# Altium schematic sheet 11_Power.SchDoc: Power (part 1 of 3)
size A3; Organization: Lime Microsystems; Address1: Surrey Tech Centre; Address2: Guildford GU2 7YG; Address3: Surrey; Address4: United Kingdom; SheetNumber: 11
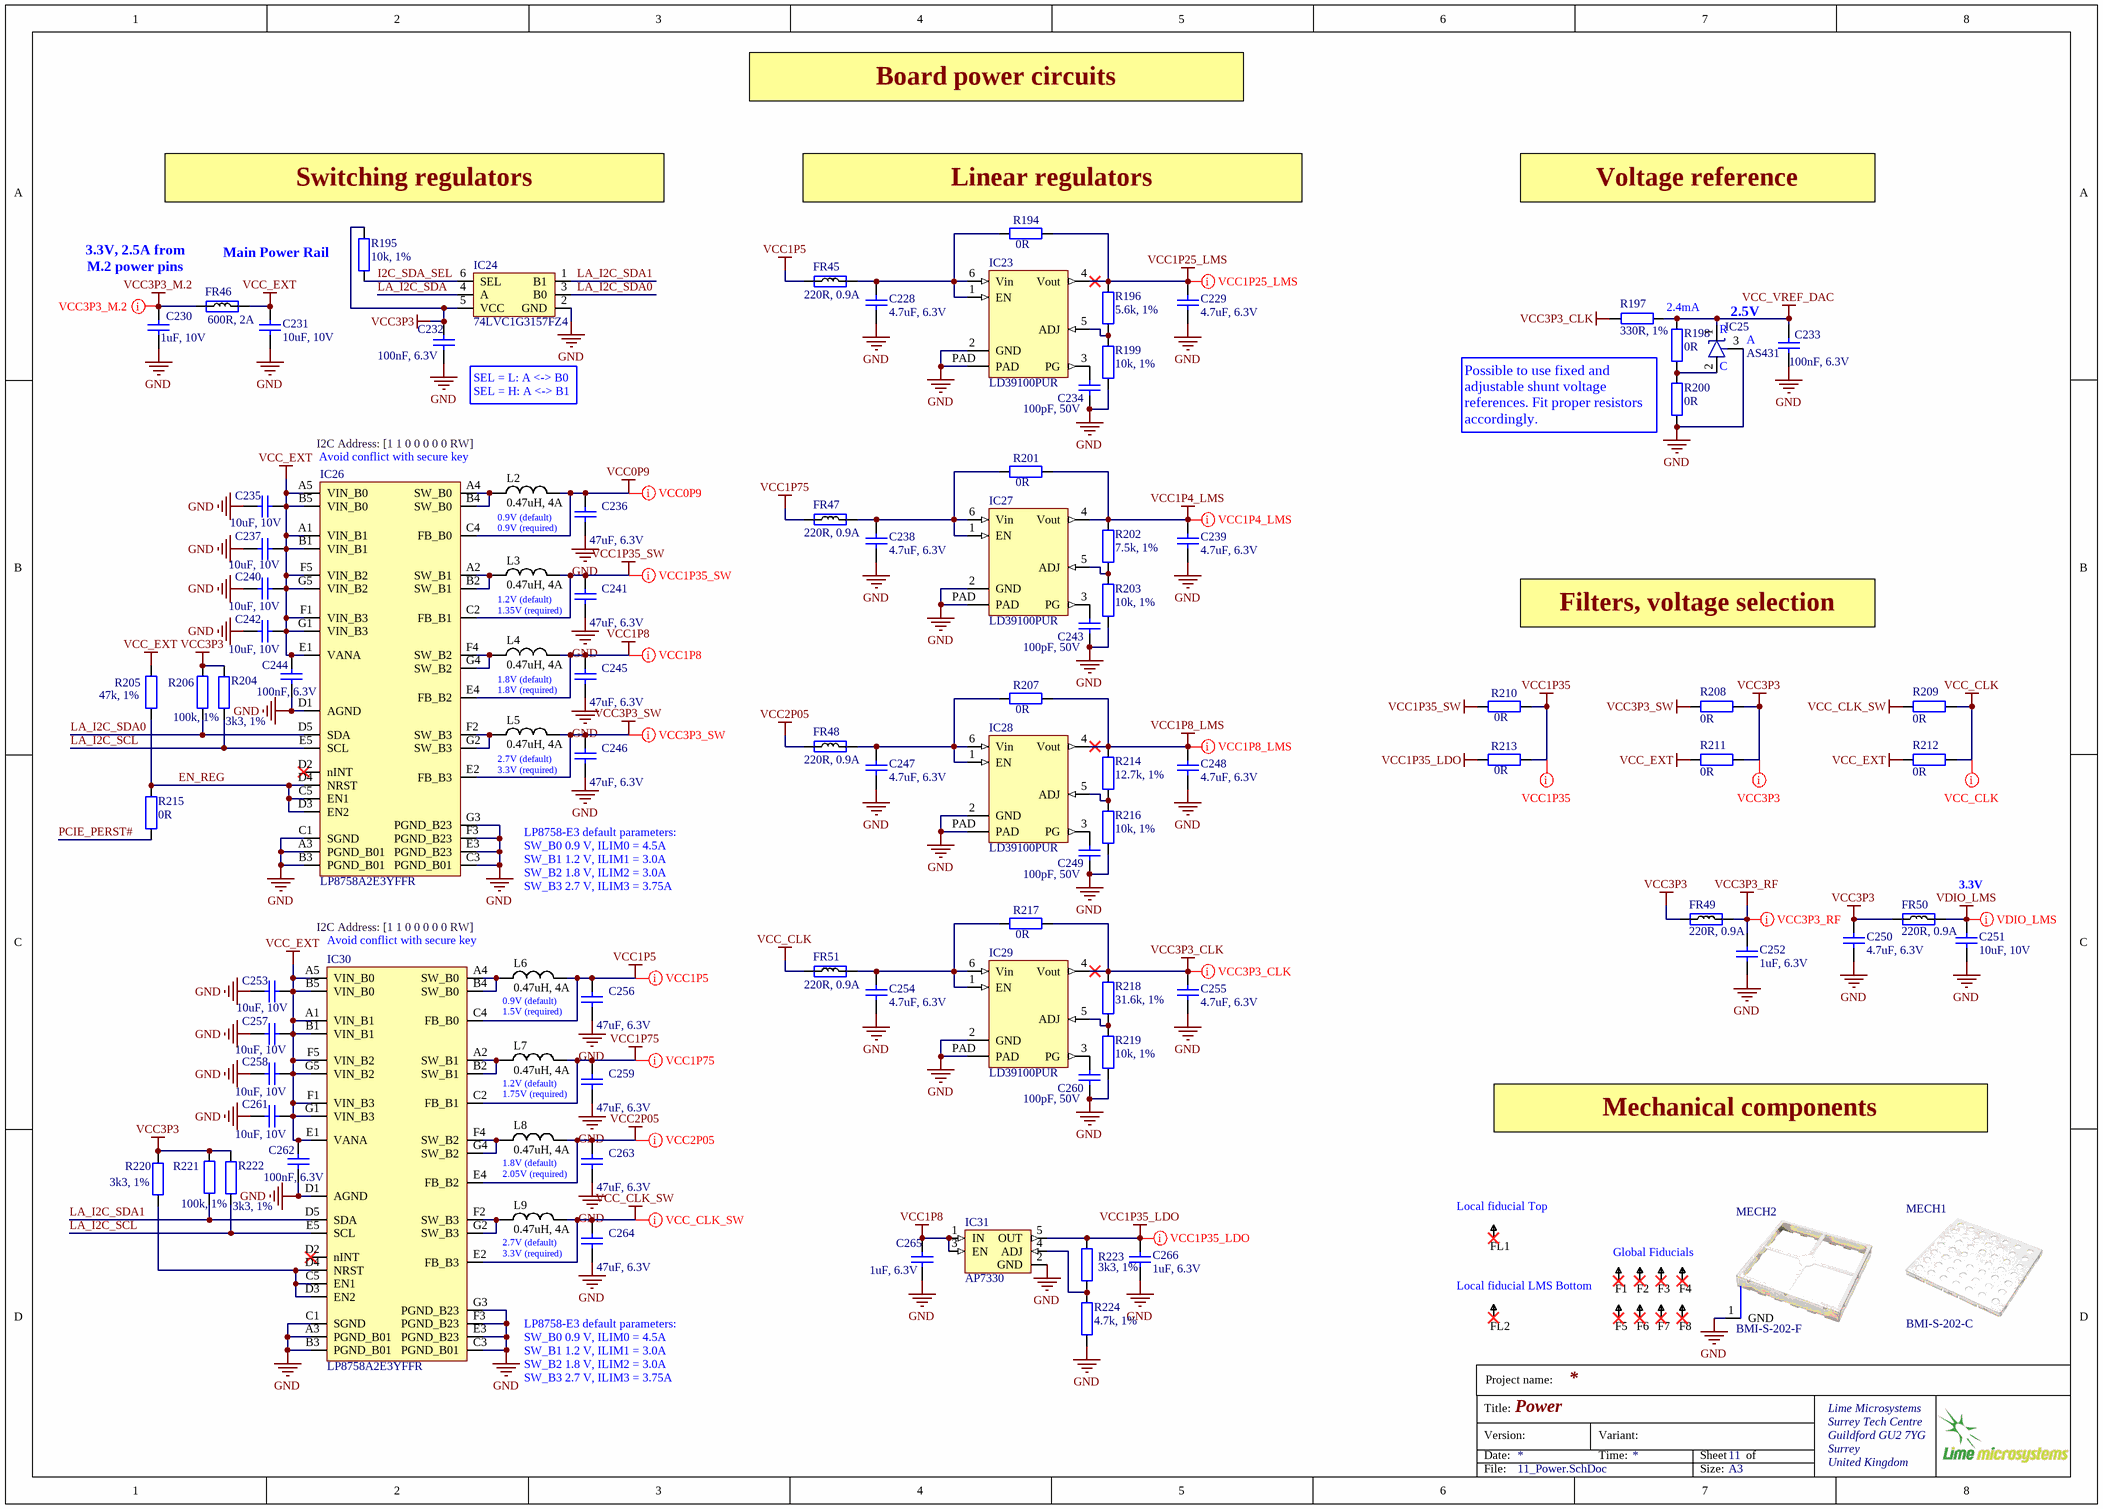
[diagram p0: 11_Power.SchDoc]

## Parts
C228  4.7uF, 6.3V  [CAP0402]
C229  4.7uF, 6.3V  [CAP0402]
C230  1uF, 10V  [CAP0402]
C231  10uF, 10V  [CAP0603]
C232  100nF, 6.3V  [CAP0201]
C233  100nF, 6.3V  [CAP0201]
C234  100pF, 50V  [CAP0201]
C235  10uF, 10V  [CAP0603]
C236  47uF, 6.3V  [CAP0603]
C237  10uF, 10V  [CAP0603]
C238  4.7uF, 6.3V  [CAP0402]
C239  4.7uF, 6.3V  [CAP0402]
C240  10uF, 10V  [CAP0603]
C241  47uF, 6.3V  [CAP0603]
C242  10uF, 10V  [CAP0603]
C243  100pF, 50V  [CAP0201]
C244  100nF, 6.3V  [CAP0201]
C245  47uF, 6.3V  [CAP0603]
C246  47uF, 6.3V  [CAP0603]
C247  4.7uF, 6.3V  [CAP0402]
C248  4.7uF, 6.3V  [CAP0402]
C249  100pF, 50V  [CAP0201]
C250  4.7uF, 6.3V  [CAP0402]
C251  10uF, 10V  [CAP0603]
C252  1uF, 6.3V  [CAP0201]
C253  10uF, 10V  [CAP0603]
C254  4.7uF, 6.3V  [CAP0402]
C255  4.7uF, 6.3V  [CAP0402]
C256  47uF, 6.3V  [CAP0603]
C257  10uF, 10V  [CAP0603]
C258  10uF, 10V  [CAP0603]
C259  47uF, 6.3V  [CAP0603]
C260  100pF, 50V  [CAP0201]
C261  10uF, 10V  [CAP0603]
C262  100nF, 6.3V  [CAP0201]
C263  47uF, 6.3V  [CAP0603]
C264  47uF, 6.3V  [CAP0603]
C265  1uF, 6.3V  [CAP0201]
C266  1uF, 6.3V  [CAP0201]
F1  Fiducial  [Fiducial]  (value not drawn)
F2  Fiducial  [Fiducial]  (value not drawn)
F3  Fiducial  [Fiducial]  (value not drawn)
F4  Fiducial  [Fiducial]  (value not drawn)
F5  Fiducial  [Fiducial]  (value not drawn)
F6  Fiducial  [Fiducial]  (value not drawn)
F7  Fiducial  [Fiducial]  (value not drawn)
F8  Fiducial  [Fiducial]  (value not drawn)
FL1  Fiducial  [Fiducial_local]  (value not drawn)
FL2  Fiducial  [Fiducial_local]  (value not drawn)
FR45  220R, 0.9A  [RES0402]
FR46  600R, 2A  [RES0805]
FR47  220R, 0.9A  [RES0402]
FR48  220R, 0.9A  [RES0402]
FR49  220R, 0.9A  [RES0402]
FR50  220R, 0.9A  [RES0402]
FR51  220R, 0.9A  [RES0402]
IC23  LD39100PUR  [LD39100PUR]
IC24  74LVC1G3157FZ4  [74LVC1G3157FZ4_SPDT_SW_DFN1410-6]
IC25  AS431  [SOT23-3_v3]
IC26  LP8758A2E3YFFR  [LP8758A1E0YFFR_QUAD_DC-DC_35DSBGA]
IC27  LD39100PUR  [LD39100PUR]
IC28  LD39100PUR  [LD39100PUR]
IC29  LD39100PUR  [LD39100PUR]
IC30  LP8758A2E3YFFR  [LP8758A1E0YFFR_QUAD_DC-DC_35DSBGA]
IC31  AP7330  [AP7330-W5-7_SOT25]
L2  0.47uH, 4A  [IND0806]
L3  0.47uH, 4A  [IND0806]
L4  0.47uH, 4A  [IND0806]
L5  0.47uH, 4A  [IND0806]
L6  0.47uH, 4A  [IND0806]
L7  0.47uH, 4A  [IND0806]
L8  0.47uH, 4A  [IND0806]
L9  0.47uH, 4A  [IND0806]
MECH1  BMI-S-202-C  [BMI-S-202-C_RF_SHIELD_COVER]
MECH2  BMI-S-202-F  [BMI-S-202-F_RF_SHIELD_FRAME_v3]
R194  0R  [RES0201]
R195  10k, 1%  [RES0201]
R196  5.6k, 1%  [RES0201]
R197  330R, 1%  [RES0201]
R198  0R  [RES0201]
R199  10k, 1%  [RES0201]
R200  0R  [RES0201]
R201  0R  [RES0201]
R202  7.5k, 1%  [RES0201]
R203  10k, 1%  [RES0201]
R204  3k3, 1%  [RES0201]
R205  47k, 1%  [RES0201]
R206  100k, 1%  [RES0201]
R207  0R  [RES0201]
R208  0R  [RES0402]
R209  0R  [RES0402]
R210  0R  [RES0201]
R211  0R  [RES0402]
R212  0R  [RES0402]
R213  0R  [RES0201]
R214  12.7k, 1%  [RES0201]
R215  0R  [RES0201]
R216  10k, 1%  [RES0201]
R217  0R  [RES0201]
R218  31.6k, 1%  [RES0201]
R219  10k, 1%  [RES0201]
R220  3k3, 1%  [RES0201]
R221  100k, 1%  [RES0201]
R222  3k3, 1%  [RES0201]
R223  3k3, 1%  [RES0201]
R224  4.7k, 1%  [RES0201]

## Nets
GND: C228.1 C229.1 C230.1 C231.1 C232.2 C233.2 C234.1 C235.1 C236.1 C237.1 C238.1 C239.1 C240.1 C241.1 C242.1 C243.1 C244.2 C245.1 C246.1 C247.1 C248.1 C249.1 C250.1 C251.1 C252.2 C253.1 C254.1 C255.1 C256.1 C257.1 C258.1 C259.1 C260.1 C261.1 C262.2 C263.1 C264.1 C265.2 C266.2 IC23.2(GND) IC23.PAD IC24.2(GND) IC25.3(NC/A) IC26.A3(PGND_B01) IC26.B3(PGND_B01) IC26.C1(SGND) IC26.C3(PGND_B01) IC26.D1(AGND) IC26.E3(PGND_B23) IC26.F3(PGND_B23) IC26.G3(PGND_B23) IC27.2(GND) IC27.PAD IC28.2(GND) IC28.PAD IC29.2(GND) IC29.PAD IC30.A3(PGND_B01) IC30.B3(PGND_B01) IC30.C1(SGND) IC30.C3(PGND_B01) IC30.D1(AGND) IC30.E3(PGND_B23) IC30.F3(PGND_B23) IC30.G3(PGND_B23) IC31.2(GND) MECH2.1(GND) R199.2 R200.2 R203.2 R216.2 R219.2 R224.2
VCC0P9: C236.2 IC26.C4(FB_B0) L2.2
VCC1P4_LMS: C239.2 IC27.4(Vout) R201.2 R202.1
VCC1P5: C256.2 FR45.1 IC30.C4(FB_B0) L6.2
VCC1P8: C245.2 C265.1 IC26.E4(FB_B2) IC31.1(IN) IC31.3(EN) L4.2
VCC1P8_LMS: C248.2 IC28.4(Vout) R207.2 R214.1
VCC1P25_LMS: C229.2 IC23.4(Vout) R194.2 R196.1
VCC1P35: R210.2 R213.2
VCC1P35_LDO: C266.1 IC31.5(OUT) R213.1 R223.1
VCC1P35_SW: C241.2 IC26.C2(FB_B1) L3.2 R210.1
VCC1P75: C259.2 FR47.1 IC30.C2(FB_B1) L7.2
VCC2P05: C263.2 FR48.1 IC30.E4(FB_B2) L8.2
VCC3P3: C232.1 C250.2 FR49.1 FR50.1 IC24.5(VCC) R195.2 R204.1 R206.1 R208.2 R211.2 R220.1 R221.1 R222.1
VCC3P3_CLK: C255.2 IC29.4(Vout) R197.2 R217.2 R218.1
VCC3P3_M.2: C230.2 FR46.1
VCC3P3_RF: C252.1 FR49.2
VCC3P3_SW: C246.2 IC26.E2(FB_B3) L5.2 R208.1
VCC_CLK: FR51.1 R209.2 R212.2
VCC_CLK_SW: C264.2 IC30.E2(FB_B3) L9.2 R209.1
VCC_EXT: C231.2 C235.2 C237.2 C240.2 C242.2 C244.1 C253.2 C257.2 C258.2 C261.2 C262.1 FR46.2 IC26.A1(VIN_B1) IC26.A5(VIN_B0) IC26.B1(VIN_B1) IC26.B5(VIN_B0) IC26.E1(VANA) IC26.F1(VIN_B3) IC26.F5(VIN_B2) IC26.G1(VIN_B3) IC26.G5(VIN_B2) IC30.A1(VIN_B1) IC30.A5(VIN_B0) IC30.B1(VIN_B1) IC30.B5(VIN_B0) IC30.E1(VANA) IC30.F1(VIN_B3) IC30.F5(VIN_B2) IC30.G1(VIN_B3) IC30.G5(VIN_B2) R205.1 R211.1 R212.1
VCC_VREF_DAC: C233.1 IC25.1(K) R197.1 R198.1
VDIO_LMS: C251.2 FR50.2
EN_REG: IC26.C5(EN1) IC26.D3(EN2) IC26.D4(NRST) R205.2 R215.2
I2C_SDA_SEL: IC24.6(SEL) R195.1
LA_I2C_SCL: IC26.E5(SCL) IC30.E5(SCL) R204.2 R222.2
LA_I2C_SDA: IC24.4(A)
LA_I2C_SDA0: IC24.3(B0) IC26.D5(SDA) R206.2
LA_I2C_SDA1: IC24.1(B1) IC30.D5(SDA) R221.2
PCIE_PERST#: R215.1
NetC228_2: C228.2 FR45.2 IC23.1(EN) IC23.6(Vin) R194.1
NetC234_2: C234.2 IC23.3(PG)
NetC238_2: C238.2 FR47.2 IC27.1(EN) IC27.6(Vin) R201.1
NetC243_2: C243.2 IC27.3(PG)
NetC247_2: C247.2 FR48.2 IC28.1(EN) IC28.6(Vin) R207.1
NetC249_2: C249.2 IC28.3(PG)
NetC254_2: C254.2 FR51.2 IC29.1(EN) IC29.6(Vin) R217.1
NetC260_2: C260.2 IC29.3(PG)
NetIC23_5: IC23.5(ADJ) R196.2 R199.1
NetIC25_2: IC25.2(A) R198.2 R200.1
NetIC26_A2: IC26.A2(SW_B1) IC26.B2(SW_B1) L3.1
NetIC26_A4: IC26.A4(SW_B0) IC26.B4(SW_B0) L2.1
NetIC26_F2: IC26.F2(SW_B3) IC26.G2(SW_B3) L5.1
NetIC26_F4: IC26.F4(SW_B2) IC26.G4(SW_B2) L4.1
NetIC27_5: IC27.5(ADJ) R202.2 R203.1
NetIC28_5: IC28.5(ADJ) R214.2 R216.1
NetIC29_5: IC29.5(ADJ) R218.2 R219.1
NetIC30_A2: IC30.A2(SW_B1) IC30.B2(SW_B1) L7.1
NetIC30_A4: IC30.A4(SW_B0) IC30.B4(SW_B0) L6.1
NetIC30_C5: IC30.C5(EN1) IC30.D3(EN2) IC30.D4(NRST) R220.2
NetIC30_F2: IC30.F2(SW_B3) IC30.G2(SW_B3) L9.1
NetIC30_F4: IC30.F4(SW_B2) IC30.G4(SW_B2) L8.1
NetIC31_4: IC31.4(ADJ) R223.2 R224.1

Not connected (* = marked no-connect by the designer): F1 1*; F2 1*; F3 1*; F4 1*; F5 1*; F6 1*; F7 1*; F8 1*; FL1 1*; FL2 1*; IC26 D2(nINT)*; IC30 D2(nINT)*

## Layout directives
net class VCC1P25_LMS: VCC1P25_LMS
net class VCC1P4_LMS: VCC1P4_LMS
net class VCC1P8_LMS: VCC1P8_LMS
net class VCC3P3_CLK: VCC3P3_CLK
net class VCC1P5: VCC1P5
net class VCC0P9: VCC0P9
net class VCC1P35_SW: VCC1P35_SW
net class VCC1P8: VCC1P8
net class VCC3P3_SW: VCC3P3_SW
net class VCC1P75: VCC1P75
net class VCC2P5: VCC2P05
net class VCC_CLK_SW: VCC_CLK_SW
net class VCC1P35_LDO: VCC1P35_LDO
net class VCC3P3_M.2: VCC3P3_M.2
net class VCC_CLK: VCC_CLK
net class VCC3P3: VCC3P3
net class VCC1P35: VCC1P35
net class VDIO_LMS: VDIO_LMS
net class VCC3P3_RF: VCC3P3_RF

## Notes on the sheet
- Board power circuits
- (near R195) Switching regulators
- (near R194) Linear regulators
- Voltage reference
- 3.3V, 2.5A from M.2 power pins
- Main Power Rail
- 2.4mA
- 2.5V
- (near IC25) C
- (near IC25) R
- (near IC25) A
- I2C Address: [1 1 0 0 0 0 0 RW]
- (near C232) SEL = L: A <-> B0
  SEL = H: A <-> B1
- Possible to use fixed and adjustable shunt voltage references. Fit proper resistors accordingly.
- Avoid conflict with secure key
- 0.9V (default)
  0.9V (required)
- 1.2V (default)
  1.35V (required)
- Filters, voltage selection
- 1.8V (default)
  1.8V (required)
- 2.7V (default)
  3.3V (required)
- LP8758-E3 default parameters:
  SW_B0 0.9 V, ILIM0 = 4.5A
  SW_B1 1.2 V, ILIM1 = 3.0A
  SW_B2 1.8 V, ILIM2 = 3.0A
  SW_B3 2.7 V, ILIM3 = 3.75A
- 3.3V
- 0.9V (default)
  1.5V (required)
- 1.2V (default)
  1.75V (required)
- Mechanical components
- 1.8V (default)
  2.05V (required)
- (near FL1) Local fiducial Top
- Global Fiducials
- Local fiducial LMS Bottom
- Project name:
- Title:
- Version:
- Date:
- Variant:
- Time:
- Sheet
- of
- File:
- Size:
- A3